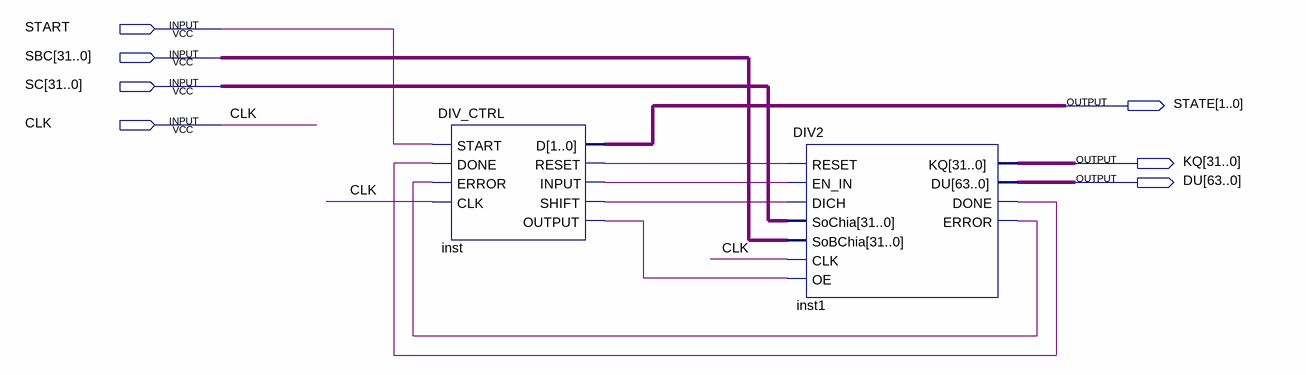
[diagram p0: schematic sheet]
// Quartus schematic DIV2wCTRL.bdf as structural Verilog: 2 symbols, 7 pins
module DIV2wCTRL (
  input  START,
  input  [31:0] SBC,
  input  [31:0] SC,
  input  CLK,
  output [1:0] STATE,
  output [31:0] KQ,
  output [63:0] DU
);

  wire inst1_done, inst1_error, inst_input, inst_output, inst_reset, inst_shift;

  DIV_CTRL inst (
    .START(START), .DONE(inst1_done), .ERROR(inst1_error), .CLK(CLK), .D(STATE), .RESET(inst_reset),
    .INPUT(inst_input), .SHIFT(inst_shift), .OUTPUT(inst_output));
  DIV2 inst1 (
    .RESET(inst_reset), .EN_IN(inst_input), .DICH(inst_shift), .SoChia(SC), .SoBChia(SBC), .CLK(CLK),
    .OE(inst_output), .KQ(KQ), .DU(DU), .DONE(inst1_done), .ERROR(inst1_error));
endmodule
